# EAGLE design TxPCB_V1-1 (EAGLE 9.6.2)
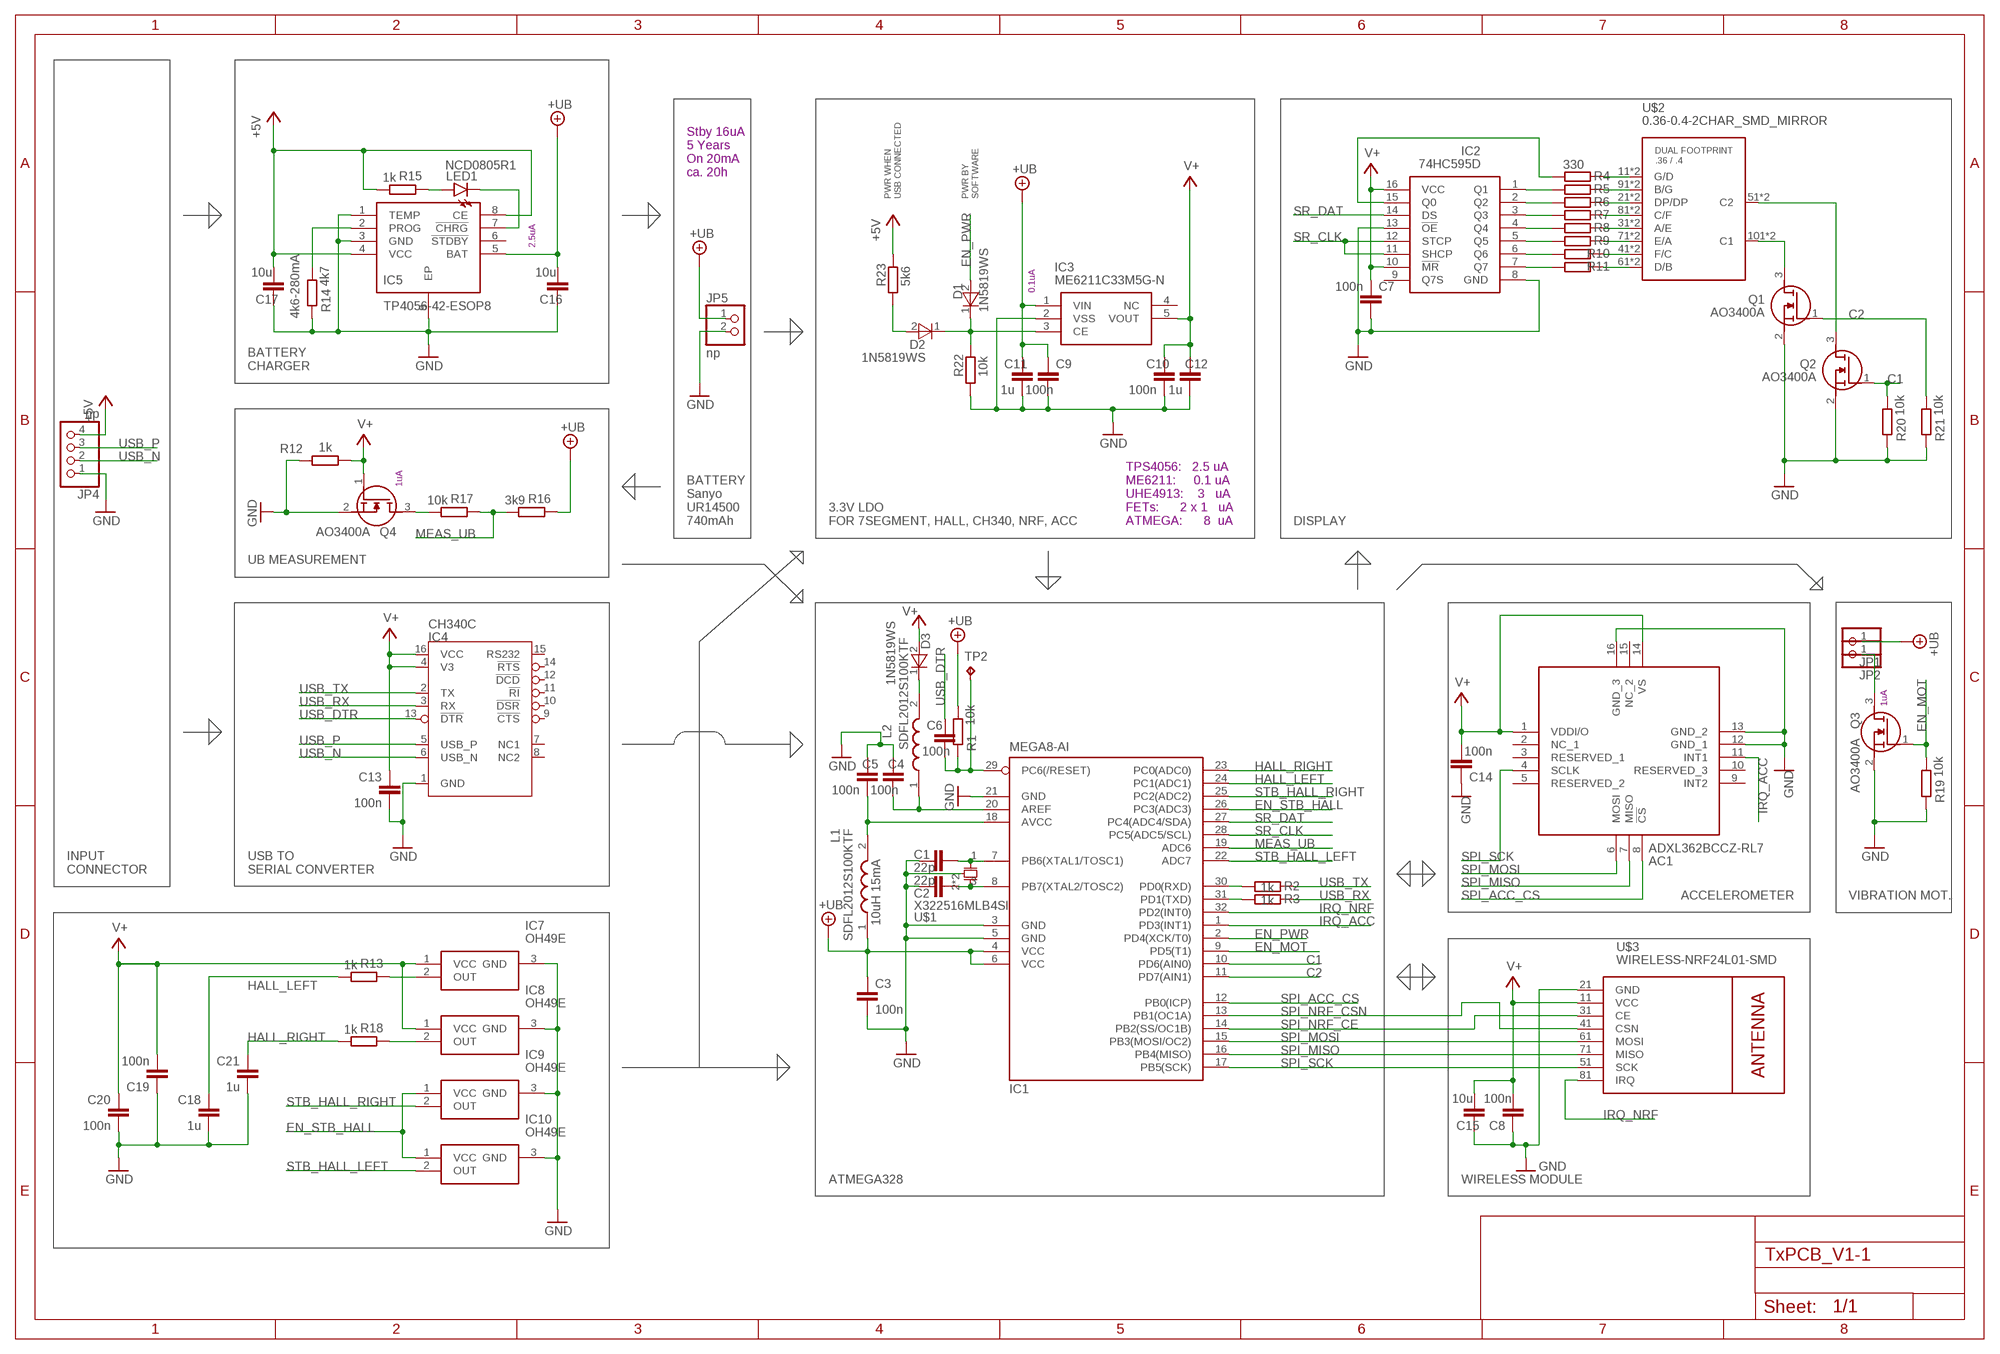
[diagram p0: schematic, sheet 1]

## Parts
AC1  ADXL362BCCZ-RL7  [CC-16-4]
C1  22p  C-EUC0603  [C0603]
C2  22p  C-EUC0603  [C0603]
C3  100n  C-EUC0603  [C0603]
C4  100n  C-EUC0603  [C0603]
C5  100n  C-EUC0603  [C0603]
C6  100n  C-EUC0603  [C0603]
C7  100n  C-EUC0603  [C0603]
C8  100n  C-EUC0603  [C0603]
C9  100n  C-EUC0603  [C0603]
C10  100n  C-EUC0603  [C0603]
C11  1u  C-EUC0603  [C0603]
C12  1u  C-EUC0603  [C0603]
C13  100n  C-EUC0603  [C0603]
C14  100n  C-EUC0603  [C0603]
C15  10u  C-EUC0603  [C0603]
C16  10u  C-EUC0603  [C0603]
C17  10u  C-EUC0603  [C0603]
C18  1u  C-EUC0603  [C0603]
C19  100n  C-EUC0603  [C0603]
C20  100n  C-EUC0603  [C0603]
C21  1u  C-EUC0603  [C0603]
D1  1N5819WS  1N4148WS  [SODFL2512X90N]
D2  1N5819WS  1N4148WS  [SODFL2512X90N]
D3  1N5819WS  1N4148WS  [SODFL2512X90N]
IC1  MEGA8-AI  [TQFP32-08]
IC2  74HC595D  [SOIC127P600X175-16N]
IC3  ME6211C33M5G-N  ME6211C50M5G  [SOT95P282X145-5N]
IC4  CH340C  CH340G  [SOIC16N]
IC5  TP4056-42-ESOP8  [SOIC127P600X175-9N]
IC7  OH49E  DRV5055A3QDBZR  [SOT95P237X112-3N]
IC8  OH49E  DRV5055A3QDBZR  [SOT95P237X112-3N]
IC9  OH49E  DRV5055A3QDBZR  [SOT95P237X112-3N]
IC10  OH49E  DRV5055A3QDBZR  [SOT95P237X112-3N]
JP1  PINHD-1X1  [1X01]
JP2  PINHD-1X1  [1X01]
JP4  np  PINHD-1X4  [1X04]
JP5  np  PINHD-1X2  [1X02]
L1  SDFL2012S100KTF  SDFL2012Q2R7KTF  [INDC2112X105N]
L2  SDFL2012S100KTF  SDFL2012Q2R7KTF  [INDC2112X105N]
LED1  NCD0805R1  LEDCHIP-LED0805  [CHIP-LED0805]
Q1  AO3400A  [SOT95P280X125-3N]
Q2  AO3400A  [SOT95P280X125-3N]
Q3  AO3400A  [SOT95P280X125-3N]
Q4  AO3400A  [SOT95P280X125-3N]
R1  10k  R-EU_R0603  [R0603]
R2  1k  R-EU_R0603  [R0603]
R3  1k  R-EU_R0603  [R0603]
R4  330  R-EU_R0603  [R0603]
R5  330  R-EU_R0603  [R0603]
R6  330  R-EU_R0603  [R0603]
R7  330  R-EU_R0603  [R0603]
R8  330  R-EU_R0603  [R0603]
R9  330  R-EU_R0603  [R0603]
R10  330  R-EU_R0603  [R0603]
R11  330  R-EU_R0603  [R0603]
R12  1k  R-EU_R0603  [R0603]
R13  1k  R-EU_R0603  [R0603]
R14  4k7  R-EU_R0603  [R0603]
R15  1k  R-EU_R0603  [R0603]
R16  3k9  R-EU_R0603  [R0603]
R17  10k  R-EU_R0603  [R0603]
R18  1k  R-EU_R0603  [R0603]
R19  10k  R-EU_R0603  [R0603]
R20  10k  R-EU_R0603  [R0603]
R21  10k  R-EU_R0603  [R0603]
R22  10k  R-EU_R0603  [R0603]
R23  5k6  R-EU_R0603  [R0603]
TP2  TPB1,27  [B1,27]
U$1  X322516MLB4SI  X322516_BETTER  [X322516MLB4SI]
U$2  0.36-0.4-2CHAR_SMD_MIRROR  [COMBO-036-04_SMD]
U$3  WIRELESS-NRF24L01-SMD  [WIRELESS-NRF24L01_SMD]

## Nets
+5V: C17.1 IC5.4(VCC) IC5.8(CE) JP4.4 R15.2 R23.2
+UB: C3.1 C9.1 C11.1 C16.1 IC1.4(VCC) IC1.6(VCC) IC3.1(VIN) IC5.5(BAT) JP1.1 JP5.1 L1.1 R1.2 R16.1
C1: IC1.10(PD6(AIN0)) Q2.1(G) R20.2
C2: IC1.11(PD7(AIN1)) Q1.1(G) R21.2
EN_MOT: IC1.9(PD5(T1)) Q3.1(G) R19.2
EN_PWR: D1.2(A) IC1.2(PD4(XCK/T0))
EN_STB_HALL: IC1.26(PC3(ADC3)) IC9.1(VCC) IC10.1(VCC)
GND: AC1.12(GND_1) AC1.13(GND_2) AC1.16(GND_3) C1.2 C2.2 C3.2 C4.1 C5.1 C7.2 C8.1 C9.2 C10.2 C11.2 C12.2 C13.2 C14.1 C15.2 C16.2 C17.2 C18.2 C19.1 C20.2 C21.2 IC1.3(GND) IC1.5(GND) IC1.21(GND) IC2.8(GND) IC2.13(!OE) IC3.2(VSS) IC4.1(GND) IC5.1(TEMP) IC5.3(GND) IC5.9(EP) IC7.3(GND) IC8.3(GND) IC9.3(GND) IC10.3(GND) JP4.1 JP5.2 Q1.2(S) Q2.2(S) Q3.2(S) Q4.2(S) R12.1 R14.1 R19.1 R20.1 R21.1 R22.1 U$1.2(G) U$1.4(G) U$3.21(GND)
HALL_LEFT: C18.1 IC1.24(PC1(ADC1)) R13.2
HALL_RIGHT: C21.1 IC1.23(PC0(ADC0)) R18.2
IRQ_ACC: AC1.11(INT1) IC1.1(PD3(INT1))
IRQ_NRF: IC1.32(PD2(INT0)) U$3.81(IRQ)
MEAS_UB: IC1.19(ADC6) R16.2 R17.1
N$1: C1.1 IC1.7(PB6(XTAL1/TOSC1)) U$1.1(X1)
N$2: C2.1 IC1.8(PB7(XTAL2/TOSC2)) U$1.3(X2)
N$3: C5.2 IC1.18(AVCC) L1.2
N$4: Q4.3(D) R17.2
N$5: C6.2 IC1.29(PC6(/RESET)) R1.1 TP2.TP
N$6: IC1.30(PD0(RXD)) R2.2
N$7: IC1.31(PD1(TXD)) R3.2
N$8: R4.1 U$2.11(G/D) U$2.12(G/D)
N$9: R5.1 U$2.91(B/G) U$2.92(B/G)
N$10: R6.1 U$2.21(DP/DP) U$2.22(DP/DP)
N$11: R7.1 U$2.81(C/F) U$2.82(C/F)
N$12: R8.1 U$2.31(A/E) U$2.32(A/E)
N$13: R9.1 U$2.71(E/A) U$2.72(E/A)
N$14: R10.1 U$2.41(F/C) U$2.42(F/C)
N$15: R11.1 U$2.61(D/B) U$2.62(D/B)
N$16: Q1.3(D) U$2.101(C1) U$2.102(C1)
N$17: Q2.3(D) U$2.51(C2) U$2.52(C2)
N$18: IC2.1(Q1) R5.2
N$19: IC2.2(Q2) R6.2
N$20: IC2.3(Q3) R7.2
N$21: IC2.4(Q4) R8.2
N$22: IC2.5(Q5) R9.2
N$23: IC2.6(Q6) R10.2
N$24: IC2.7(Q7) R11.2
N$25: IC2.15(Q0) R4.2
N$26: D2.2(A) R23.1
N$27: C4.2 IC1.20(AREF) L2.1
N$28: D3.1(K) L2.2
N$30: IC8.2(OUT) R18.1
N$31: D1.1(K) D2.1(K) IC3.3(CE) R22.2
N$32: LED1.A R15.1
N$33: IC5.7(!CHRG) LED1.C
N$34: JP2.1 Q3.3(D)
N$35: IC5.2(PROG) R14.2
N$36: IC7.2(OUT) R13.1
SPI_ACC_CS: AC1.8(!CS) IC1.12(PB0(ICP))
SPI_MISO: AC1.7(MISO) IC1.16(PB4(MISO)) U$3.71(MISO)
SPI_MOSI: AC1.6(MOSI) IC1.15(PB3(MOSI/OC2)) U$3.61(MOSI)
SPI_NRF_CE: IC1.14(PB2(SS/OC1B)) U$3.31(CE)
SPI_NRF_CSN: IC1.13(PB1(OC1A)) U$3.41(CSN)
SPI_SCK: AC1.4(SCLK) IC1.17(PB5(SCK)) U$3.51(SCK)
SR_CLK: IC1.28(PC5(ADC5/SCL)) IC2.11(SHCP) IC2.12(STCP)
SR_DAT: IC1.27(PC4(ADC4/SDA)) IC2.14(DS)
STB_HALL_LEFT: IC1.22(ADC7) IC10.2(OUT)
STB_HALL_RIGHT: IC1.25(PC2(ADC2)) IC9.2(OUT)
USB_DTR: C6.1 IC4.13(!DTR)
USB_N: IC4.6(USB_N) JP4.2
USB_P: IC4.5(USB_P) JP4.3
USB_RX: IC4.3(RX) R3.1
USB_TX: IC4.2(TX) R2.1
V+: AC1.1(VDDI/O) AC1.14(VS) C7.1 C8.2 C10.1 C12.1 C13.1 C14.2 C15.1 C19.2 C20.1 D3.2(A) IC2.10(!MR) IC2.16(VCC) IC3.5(VOUT) IC4.4(V3) IC4.16(VCC) IC7.1(VCC) IC8.1(VCC) Q4.1(G) R12.2 U$3.11(VCC)
Unconnected: AC1.2(NC_1) AC1.3(RESERVED_1) AC1.5(RESERVED_2) AC1.9(INT2) AC1.10(RESERVED_3) AC1.15(NC_2) IC2.9(Q7S) IC3.4(NC) IC4.7(NC1) IC4.8(NC2) IC4.9(!CTS) IC4.10(!DSR) IC4.11(!RI) IC4.12(!DCD) IC4.14(!RTS) IC4.15(RS232) IC5.6(!STDBY)

## Notes on the sheet
- Stby 16uA
  5 Years
  On 20mA
  ca. 20h
- PWR WHEN
  USB CONNECTED
- PWR BY
  SOFTWARE
- 2.5uA
- 0.1uA
- 4k6-280mA
- BATTERY
  CHARGER
- 1uA
- BATTERY
  Sanyo
  UR14500
  740mAh
- 3.3V LDO
  FOR 7SEGMENT, HALL, CH340, NRF, ACC
- TPS4056:   2.5 uA
  ME6211:     0.1 uA
  UHE4913:    3   uA
  FETs:      2 x 1   uA
  ATMEGA:      8  uA
- DISPLAY
- UB MEASUREMENT
- 1uA
- INPUT
  CONNECTOR
- USB TO
  SERIAL CONVERTER
- ACCELEROMETER | VIBRATION MOT.
- 10uH 15mA
- ATMEGA328 | WIRELESS MODULE

## Library data of the parts
AC1 = ADXL362BCCZ-RL7:ADXL362BCCZ-RL7: Accelerometers Micropower 3-Axis Digital Output MEMS Source: Datasheet <http://www.analog.com/media/en/technical-documentation/data-sheets/ADXL362.pdf>; ARROW_PART_NUMBER: ADXL362BCCZ-RL7; ARROW_PRICE-STOCK: https://www.arrow.com/en/products/adxl362bccz-rl7/analog-devices?region=nac; DESCRIPTION: Accelerometers Micropower 3-Axis Digital Output MEMS; HEIGHT: mm; MANUFACTURER_NAME: Analog Devices; MANUFACTURER_PART_NUMBER: ADXL362BCCZ-RL7; MOUSER_PART_NUMBER: 584-ADXL362BCCZ-R7; MOUSER_PRICE-STOCK: https://www.mouser.co.uk/ProductDetail/Analog-Devices/ADXL362BCCZ-RL7?qs=WIvQP4zGanhCOhEEyirq5Q%3D%3D
C1-C21 = rcl:C-EU: CAPACITOR, European symbol; SPICEPREFIX: C
D1-D3 = 1N4148WS:1N4148WS: ON Semiconductor Switching Diode, 300mA 75V, 2-Pin SOD-323 1N4148WS Source: Datasheet; ARROW_PART_NUMBER: 1N4148WS; ARROW_PRICE-STOCK: https://www.arrow.com/en/products/1n4148ws/on-semiconductor?region=nac; DESCRIPTION: ON Semiconductor Switching Diode, 300mA 75V, 2-Pin SOD-323 1N4148WS; HEIGHT: 0.9mm; MANUFACTURER_NAME: onsemi; MANUFACTURER_PART_NUMBER: 1N4148WS; MOUSER_PART_NUMBER: 512-1N4148WS; MOUSER_PRICE-STOCK: https://www.mouser.co.uk/ProductDetail/ON-Semiconductor-Fairchild/1N4148WS?qs=2%2FYqgE%252BHg%252BKBrKZlAsMLhw%3D%3D
IC1 = atmel:MEGA8: MICROCONTROLLER 8 Kbytes FLASH, 1 kbytes SRAM, 512 bytes EEPROM, USART, 6-channel 10 bit ADC, 2-channel 8 bit ADC Pin compatible with Atmega48, ATMega88, ATMega168 Source: avr.lbr; MPN: ATMEGA8-16AU; OC_FARNELL: 9171371; OC_NEWARK: 73M8863
IC2 = 74HC595D:74HC595D: Shift Register, 16 Pin, Plastic, SOP Source: Datasheet <https://assets.nexperia.com/documents/data-sheet/74HC_HCT595.pdf>; DESCRIPTION: Shift Register, 16 Pin, Plastic, SOP; HEIGHT: 1.75mm; MANUFACTURER_NAME: NXP; MANUFACTURER_PART_NUMBER: 74HC595D; MOUSER_PART_NUMBER: N/A; MOUSER_PRICE-STOCK: https://www.mouser.co.uk/ProductDetail/NXP-Semiconductors/74HC595D?qs=KBAwV6Cvgt0f%252BALigJeNTw%3D%3D
IC3 = ME6211C50M5G:ME6211C50M5G: ME6211C50M5G Source: Datasheet <https://atta.szlcsc.com/upload/public/pdf/source/20180709/C236670_CE73D272779D26EBD8CFC2246415DB9C.pdf>; DESCRIPTION: ME6211C50M5G; HEIGHT: 1.45mm; MANUFACTURER_NAME: Microne; MANUFACTURER_PART_NUMBER: ME6211C50M5G
IC4 = CH340:CH340G
IC5 = TP4056-42-ESOP8:TP4056-42-ESOP8: PMIC - Battery Management ESOP-8 RoHS Source: Datasheet <https://datasheet.lcsc.com/szlcsc/1906261508_Nanjing-Extension-Microelectronics-TP4056-42-ESOP8_C16581.pdf>; DESCRIPTION: PMIC - Battery Management ESOP-8 RoHS; HEIGHT: 1.75mm; MANUFACTURER_NAME: Nanjing Extension Microelectronics; MANUFACTURER_PART_NUMBER: TP4056-42-ESOP8
IC7-IC10 = DRV5055A3QDBZR:DRV5055A3QDBZR: Hall Effect Sensor 1mA Ratiometric 3.3V/5V 3-Pin SOT-23 T/R Source: Datasheet <http://www.ti.com/general/docs/suppproductinfo.tsp?distId=10&gotoUrl=http://www.ti.com/lit/gpn/drv5055>; ARROW_PART_NUMBER: DRV5055A3QDBZR; ARROW_PRICE-STOCK: https://www.arrow.com/en/products/drv5055a3qdbzr/texas-instruments; DESCRIPTION: Hall Effect Sensor 1mA Ratiometric 3.3V/5V 3-Pin SOT-23 T/R; HEIGHT: 1.12mm; MANUFACTURER_NAME: Texas Instruments; MANUFACTURER_PART_NUMBER: DRV5055A3QDBZR; MOUSER_PART_NUMBER: 595-DRV5055A3QDBZR; MOUSER_PRICE-STOCK: https://www.mouser.co.uk/ProductDetail/Texas-Instruments/DRV5055A3QDBZR?qs=rrS6PyfT74dO6qwrOH6T8w%3D%3D
JP1 JP2 = pinhead:PINHD-1X1: PIN HEADER
JP4 = pinhead:PINHD-1X4: PIN HEADER
JP5 = pinhead:PINHD-1X2: PIN HEADER
L1 L2 = SDFL2012Q2R7KTF:SDFL2012Q2R7KTF: Multi-layer Chip Ferrite Inductor Source: Datasheet <https://datasheet.lcsc.com/szlcsc/Sunlord-SDFL2012Q2R7KTF_C74318.pdf>; DESCRIPTION: Multi-layer Chip Ferrite Inductor; HEIGHT: 1.05mm; MANUFACTURER_NAME: SUNLORD; MANUFACTURER_PART_NUMBER: SDFL2012Q2R7KTF
LED1 = led:LED: LED OSRAM: - CHIPLED LG R971, LG N971, LY N971, LG Q971, LY Q971, LO R971, LY R971 LH N974, LH R974 LS Q976, LO Q976, LY Q976 LO Q996 - Hyper CHIPLED LW Q18S LB Q993, LB Q99A, LB R99A - SideLED LS A670, LO A670, LY A670, LG A670, LP A670 LB A673, LV A673, LT A673, LW A673 LH A674 LY A675 LS A676, LA A676, LO A676, LY A676, LW A676 LS A679, LY A679, LG A679 - Hyper Micro SIDELED® LS Y876, LA Y876, LO Y876, LY Y876 LT Y87S - SmartLED LW L88C, LW L88S LB L89C, LB L89S, LG L890 LS L89K, LO L89K, LY L89K LS L896, LA L896, LO L896, LY L896 - TOPLED LS T670, LO T670, LY T670, LG T670, LP T670 LSG T670, LSP T670, LSY T670, LOP T670, LYG T670 LG T671, LOG T671, LSG T671 LB T673, LV T673, LT T673, LW T673 LH T674 LS T676, LA T676, LO T676, LY T676, LB T676, LH T676, LSB T676, LW T676 LB T67C, LV T67C, LT T67C, LS T67K, LO T67K, LY T67K, LW E67C LS E67B, LA E67B, LO E67B, LY E67B, LB E67C, LV E67C, LT E67C LW T67C LS T679, LY T679, LG T679 LS T770, LO T770, LY T770, LG T770, LP T770 LB T773, LV T773, LT T773, LW T773 LH T774 LS E675, LA E675, LY E675, LS T675 LS T776, LA T776, LO T776, LY T776, LB T776 LHGB T686 LT T68C, LB T68C - Hyper Mini TOPLED® LB M676 - Mini TOPLED Santana® LG M470 LS M47K, LO M47K, LY M47K Source: http://www.osram.convergy.de LUXEON: - LUMILED® LXK2-PW12-R00, LXK2-PW12-S00, LXK2-PW14-U00, LXK2-PW14-V00 LXK2-PM12-R00, LXK2-PM12-S00, LXK2-PM14-U00 LXK2-PE12-Q00, LXK2-PE12-R00, LXK2-PE12-S00, LXK2-PE14-T00, LXK2-PE14-U00 LXK2-PB12-K00, LXK2-PB12-L00, LXK2-PB12-M00, LXK2-PB14-N00, LXK2-PB14-P00, LXK2-PB14-Q00 LXK2-PR12-L00, LXK2-PR12-M00, LXK2-PR14-Q00, LXK2-PR14-R00 LXK2-PD12-Q00, LXK2-PD12-R00, LXK2-PD12-S00 LXK2-PH12-R00, LXK2-PH12-S00 LXK2-PL12-P00, LXK2-PL12-Q00, LXK2-PL12-R00 Source: www.luxeon.com KINGBRIGHT: KA-3528ASYC Source: www.kingbright.com
Q1-Q4 = AO3400A:AO3400A: 30V N-Channel MOSFET Source: Datasheet <http://aosmd.com/res/data_sheets/AO3400A.pdf>; ARROW_PART_NUMBER: AO3400A; ARROW_PRICE-STOCK: https://www.arrow.com/en/products/ao3400a/alpha-and-omega-semiconductor?region=nac; DESCRIPTION: 30V N-Channel MOSFET; HEIGHT: 1.25mm; MANUFACTURER_NAME: Alpha & Omega Semiconductors; MANUFACTURER_PART_NUMBER: AO3400A
R1-R23 = rcl:R-EU_: RESISTOR, European symbol; SPICEPREFIX: R
TP2 = testpad:TP: Test pad
U$1 = X322516MLB4SI:X322516_BETTER
U$2 = 7SEG_36_40_COMBO:0.36-0.4-2CHAR_SMD_MIRROR
U$3 = diy-modules:WIRELESS-NRF24L01-SMD

## Board
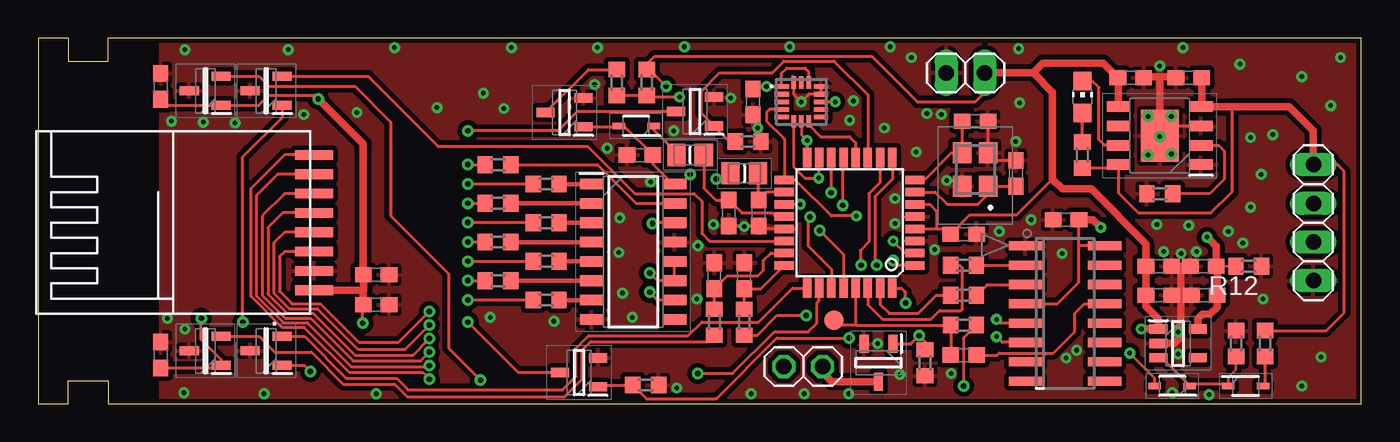
[diagram p1: board, top side]
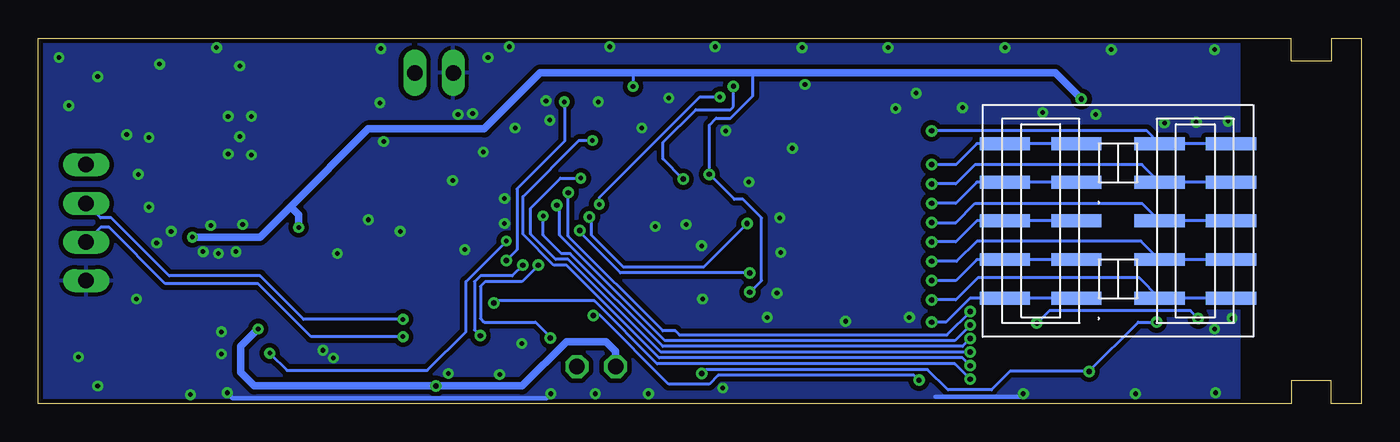
[diagram p2: board, bottom side, seen from below]

Size 86.98 x 24 mm. Coordinates in mm from the lower left corner, seen from the top.
Outline: 0,0 2,0 2,1.5 4.6,1.5 4.6,0 86.98,0 86.98,24 4.6,24 4.6,22.5 2,22.5 2,24 0,24 0,0
Copper layers (1*16): Top 0.035mm / dielectric 1.5mm / Bottom 0.035mm
Design rules "jlcpcb *": minimum track width 3.5mil, minimum drill 0.2mm, track to track 3.5mil, track to pad 5mil, pad to pad 5mil, via to via 5mil, smd to smd 0mil, copper to edge 0.2mm, drill to drill 8mil, minimum pad ring 10mil, minimum via ring 8mil, stop-mask expansion 4mil, vias tented up to drill 0mil, thermal gap 10mil
tRestrict: area -0.6,-1.1 to 7.6,25.5
bRestrict: area -0.6,-1.1 to 7.6,25.5

### Footprints (pad centres in the part's own frame; a part is rotated, then mirrored left to right if it is on the bottom)
CC-16-4 = smd 0.925 x 0.3: 1 -1.288,1; 2 -1.288,0.5; 3 -1.288,0; 4 -1.288,-0.5; 5 -1.288,-1; 9 1.288,-1; 10 1.288,-0.5; 11 1.288,0; 12 1.288,0.5; 13 1.288,1 | smd 0.3 x 0.8: 6 -0.5,-1.275; 7 0,-1.275; 8 0.5,-1.275; 14 0.5,1.275; 15 0,1.275; 16 -0.5,1.275
C0603 = smd 1.1 x 1: 1 -0.85,0; 2 0.85,0
SODFL2512X90N = smd 0.82 x 0.42: 1 -1.15,0; 2 1.15,0
TQFP32-08 = smd 1.27 x 0.559: 1 -4.293,2.8; 2 -4.293,2; 3 -4.293,1.2; 4 -4.293,0.4; 5 -4.293,-0.4; 6 -4.293,-1.2; 7 -4.293,-2; 8 -4.293,-2.8; 17 4.293,-2.8; 18 4.293,-2; 19 4.293,-1.2; 20 4.293,-0.4; 21 4.293,0.4; 22 4.293,1.2; 23 4.293,2; 24 4.293,2.8 | smd 0.559 x 1.27: 9 -2.8,-4.293; 10 -2,-4.293; 11 -1.2,-4.293; 12 -0.4,-4.293; 13 0.4,-4.293; 14 1.2,-4.293; 15 2,-4.293; 16 2.8,-4.293; 25 2.8,4.293; 26 2,4.293; 27 1.2,4.293; 28 0.4,4.293; 29 -0.4,4.293; 30 -1.2,4.293; 31 -2,4.293; 32 -2.8,4.293
SOIC127P600X175-16N = smd 1.55 x 0.7: 1 -2.725,4.445; 2 -2.725,3.175; 3 -2.725,1.905; 4 -2.725,0.635; 5 -2.725,-0.635; 6 -2.725,-1.905; 7 -2.725,-3.175; 8 -2.725,-4.445; 9 2.725,-4.445; 10 2.725,-3.175; 11 2.725,-1.905; 12 2.725,-0.635; 13 2.725,0.635; 14 2.725,1.905; 15 2.725,3.175; 16 2.725,4.445
SOT95P282X145-5N = smd 1.2 x 0.6: 1 -1.3,0.95; 2 -1.3,0; 3 -1.3,-0.95; 4 1.3,-0.95; 5 1.3,0.95
SOIC16N = smd 2.2 x 0.6: 1 -2.6,4.445; 2 -2.6,3.175; 3 -2.6,1.905; 4 -2.6,0.635; 5 -2.6,-0.635; 6 -2.6,-1.905; 7 -2.6,-3.175; 8 -2.6,-4.445; 9 2.6,-4.445; 10 2.6,-3.175; 11 2.6,-1.905; 12 2.6,-0.635; 13 2.6,0.635; 14 2.6,1.905; 15 2.6,3.175; 16 2.6,4.445
SOIC127P600X175-9N = smd 1.525 x 0.7: 1 -2.712,1.905; 2 -2.712,0.635; 3 -2.712,-0.635; 4 -2.712,-1.905; 5 2.712,-1.905; 6 2.712,-0.635; 7 2.712,0.635; 8 2.712,1.905 | smd 2.513 x 3.402: 9 0,0
SOT95P237X112-3N = smd 1.25 x 0.6: 1 -1.05,0.95; 2 -1.05,-0.95; 3 1.05,0
1X01 = drill 1.016 octagon: 1 0,0
1X04 = drill 1.016 long: 1 -3.81,0; 2 -1.27,0; 3 1.27,0; 4 3.81,0
1X02 = drill 1.016 long: 1 -1.27,0; 2 1.27,0
INDC2112X105N = smd 1.2 x 1.45: 1 -0.9,0; 2 0.9,0
CHIP-LED0805 = smd 1.2 x 1.2: A 0,-1.05; C 0,1.05
SOT95P280X125-3N = smd 1.2 x 0.6: 1 -1.25,0.95; 2 -1.25,-0.95; 3 1.25,0
R0603 = smd 1 x 1.1: 1 -0.85,0; 2 0.85,0
B1,27 = smd 1.27 x 1.27: TP 0,0
X322516MLB4SI = smd 1.4 x 1.2: 1 -1.1,-0.85; 2 1.1,-0.85; 3 1.1,0.85; 4 -1.1,0.85
COMBO-036-04_SMD = smd 0.85 x 3.3: 11 -5.08,-7.43; 12 -5.08,-2.73; 21 -2.54,-7.43; 22 -2.54,-2.73; 31 0,-7.43; 32 0,-2.73; 41 2.54,-7.43; 42 2.54,-2.73; 51 5.08,-7.43; 52 5.08,-2.73; 61 5.08,2.73; 62 5.08,7.43; 71 2.54,2.73; 72 2.54,7.43; 81 0,2.73; 82 0,7.43; 91 -2.54,2.73; 92 -2.54,7.43; 101 -5.08,2.73; 102 -5.08,7.43
WIRELESS-NRF24L01_SMD = smd 2.5 x 0.635: 11 -9.153,4.445; 21 -9.153,3.175; 31 -9.153,1.905; 41 -9.153,0.635; 51 -9.153,-0.635; 61 -9.153,-1.905; 71 -9.153,-3.175; 81 -9.153,-4.445

### Placement (x,y rotation side)
AC1  50.16,19.82 0 top
C1  64.26,15.12 90 top
C2  61.59,18.55 0 top
C3  60.83,11.12 0 top
C4  45.4,12.52 90 top
C5  47.37,12.52 90 top
C6  60.83,3.18 180 top
C7  39.56,16.33 180 top
C8  22.23,8.45 180 top
C9  73.66,7.12 0 top
C10  76.64,7.12 180 top
C11  73.66,9.03 0 top
C12  76.58,9.03 180 top
C13  67.56,12.07 180 top
C14  46.99,19.82 90 top
C15  22.23,6.49 0 top
C16  71.82,21.41 0 top
C17  75.63,21.41 180 top
C18  46.42,8.39 90 top
C19  8.06,3.18 270 top
C20  8.06,20.84 90 top
C21  44.45,8.39 90 top
D1  74.55,1.15 180 top
D2  79.38,1.15 0 top
D3  39.31,18.23 180 top
IC1  53.34,11.88 180 top
IC2  39.12,9.97 0 top
IC3  74.93,3.95 0 top
IC4  67.5,5.91 0 top
IC5  73.72,17.6 180 top
IC7  11,20.54 180 top
IC8  11,3.46 180 top
IC9  15,3.46 180 top
IC10  15,20.54 180 top
JP1  49.02,2.42 0 top
JP2  51.56,2.42 0 top
JP4  83.82,11.88 90 top
JP5  60.96,21.73 180 top
L1  46.42,15.12 0 top
L2  42.86,16.33 180 top
LED1  68.64,20.14 0 top
Q1  43.18,19.18 180 top
Q2  35.56,2.04 180 top
Q3  55.24,2.67 270 top
Q4  34.61,19.12 180 top
R1  60.83,5.15 0 top
R2  60.83,9.09 180 top
R3  60.83,7.12 180 top
R4  30.23,15.69 0 top
R5  33.4,14.42 0 top
R6  30.23,13.15 0 top
R7  33.4,11.88 0 top
R8  30.23,10.61 0 top
R9  33.4,9.34 0 top
R10  30.23,8.07 0 top
R11  33.4,6.8 0 top
R12  79.57,9.03 180 top
R13  46.42,5.34 90 top
R14  73.72,13.79 0 top
R15  68.64,16.33 270 top
R16  40.01,21.09 270 top
R17  38.04,21.09 90 top
R18  44.45,5.34 90 top
R19  58.29,2.67 90 top
R20  39.94,1.21 180 top
R21  46.67,17.22 180 top
R22  78.74,3.95 270 top
R23  80.64,3.95 90 top
TP2  52.32,5.47 0 top
U$1  61.59,15.38 90 top
U$2  16,12 270 bottom
U$3  9,11.88 180 top

### Tracks (layer width: path | path; a pad name or v marks a point on that pad's centre or on a via)
+5V
  Top 0.2: R15.2 70.8,15.48 IC5.8 71.01,13.83 72.33,12.52 77.09,12.52 78.49,13.91 78.49,19.5 | R23.2 84.67,4.79 85.85,5.98 85.85,15.25 85.41,15.69 JP4.4
  Top 0.508: C17.1 76.48,19.55 IC5.4 78.49,19.5 82.23,19.5 83.82,17.91 JP4.4
+UB  (via drill 0.3 pad 0.4, 0.35)
  Top 0.2: JP5.1 62.23,20.45 61.59,19.82 57.78,19.82 54.8,22.8 40.52,22.8 40.01,22.29 R16.1 40.17,21.94 v41.27,20.84 | IC1.4 59.05,11.48 | 59.05,11.48 59.05,12.64 58.62,13.08 IC1.6 | 59.05,11.48 59.62,11.48 C3.1 61.25,12.39 64.33,12.39 66.67,14.74 | R1.2 60.83,4.3 v60.83,1.15 | L1.1 45.14,14.74 v44.58,14.74
  Top 0.508: IC5.5 71.01,21.36 C16.1 70.02,22.36 66.04,22.36 65.41,21.73 | 65.41,21.73 JP5.1 | 65.41,21.73 66.67,20.45 66.67,14.74 67.31,14.11 69.22,14.11 72.81,10.51 C11.1 C9.1 72.81,6.38 73.63,5.56 IC3.1 v72.52,4.9
  Bottom 0.2: v44.58,14.74 45.91,16.07 45.91,17.15 43.75,19.31 41.47,19.31 41.27,19.5 v41.27,20.84
  Bottom 0.508: v72.52,4.9 73.66,3.75 73.66,2.04 72.77,1.15 v60.83,1.15 55.18,1.15 52.26,4.07 49.66,4.07 49.02,3.44 JP1.1
C1  (via drill 0.35)
  Top 0.2: Q2.1 36.93,1.21 R20.2 39.98,0.33 44.58,0.33 48.55,4.29 v53.31,4.29 | IC1.10 55.34,14.52 54.61,13.79 54.61,10.61 54.04,10.04 54.04,9.15 v54.1,9.09
  Bottom 0.2: v54.1,9.09 55.18,8.01 57.59,8.01 57.91,7.69 57.91,5.6 57.66,5.34 54.29,5.34 53.28,4.33 v53.31,4.29
C2
  Top 0.2: IC1.11 54.54,20.27 52.32,22.49 49.02,22.49 48.26,21.73 44.8,21.73 43.6,20.53 43.6,19.06 Q1.1 44.43,18.19 45.4,17.22 R21.2
EN_MOT  (via drill 0.35)
  Top 0.2: IC1.9 56.14,14.75 54.99,13.6 54.99,9.22 v55.12,9.09 | R19.2 58.29,4.07 v57.91,4.45 57.38,3.92 Q3.1
  Bottom 0.2: v55.12,9.09 55.82,8.39 57.91,8.39 58.29,8.01 58.29,4.83 v57.91,4.45
EN_PWR  (via drill 0.3 pad 0.4)
  Top 0.2: D1.2 73.4,1.67 v71.75,3.31 | v56.2,10.68 56.99,9.88 IC1.2
  Bottom 0.2: v56.2,10.68 58.86,8.01 58.86,4.71 61.4,2.18 70.62,2.18 v71.75,3.31
EN_STB_HALL  (via drill 0.35)
  Top 0.2: IC9.1 17.5,2.51 v17.91,2.1 | v13.46,5.34 13.46,16.2 16.07,18.8 16.07,19.58 IC10.1 | IC1.26 51.34,6.77 51.18,6.61 51.18,5.28 50.61,4.71 48.39,4.71 45.66,1.98 v43.37,1.98
  Bottom 0.2: v13.46,5.34 14.67,5.34 v17.91,2.1 23.11,2.1 24.32,0.9 27.18,0.9 28.51,2.23 43.05,2.23 43.31,1.98 v43.37,1.98
GND  (via drill 0.3 pad 0.4)
  Top 0.2: C2.2 U$1.2 62.95,15.97 C1.2 | C4.1 C5.1 47.56,11.48 IC1.21 | AC1.16 49.66,20.32 v50.16,19.82 50.66,20.32 AC1.12 AC1.13 | 73.72,16.64 IC5.9 73.72,17.98 73.98,18.23 IC5.3 | C14.1 47.31,18.65 v47.31,18.11 47.31,17.43 R21.1
  Top 0.508: IC3.2 74.68,3.95 75.12,4.39 75.12,7.12 | C11.2 75.12,9.03 | 75.12,9.03 C12.2 | C9.2 75.12,7.12 | C10.2 75.12,7.12 | 75.12,7.12 75.12,9.03 | C16.2 72.73,21.47 73.72,21.47 | 73.72,21.47 74.72,21.47 C17.2 | IC5.9 73.72,21.47
  Bottom 0.305: v22.23,0.64 22.42,0.45 28,0.45 | v53.28,0.64 53.57,0.35 74.19,0.35 v74.55,0.71
  other vias: 59.73,14.66 39.05,5.66 38.23,12.2 64.26,17.22 29.27,20.39 26.23,19.44 30.61,19.38 72.96,18.87 74.49,18.87 74.49,16.39 72.96,16.33 73.72,17.53 75.12,9.85 74.93,3.25 67.31,9.85 65.28,12.07 46.42,11.63 63.18,11.31 73.72,22.17 45.53,20.07 46.86,0.64 60.01,1.98 56.64,1.91 67.56,2.99 55.18,3.95 41.78,17.91 40.26,14.55 56.32,11.82 55.63,18.11 57.72,16.52 53.34,18.61 53.59,19.88 59.37,18.99 58.42,19.06 56.32,13.47 78.23,11.31 79.69,12.9 79.69,17.47 79.18,10.55 73.53,11.76 75.63,11.69 73.98,9.98 76.14,9.98 74.93,4.71 80.39,15.06 78.99,22.3 57.4,22.74 64.52,19.76 80.52,6.87 81.15,17.66 83.06,21.47 84.96,19.57 85.6,22.74 83.06,1.15 84.33,3.06 36.58,20.96 37.4,16.77 41.97,1.02 29.72,5.66 33.91,5.41 38.42,7.25 38.16,9.91 9.65,23.25 16.45,23.25 23.43,23.38 31.11,23.38 36.77,23.38 42.48,23.44 49.4,23.44 56.01,23.44 68.26,3.5 17.46,18.99 20.95,19.12 12.95,18.42 8.76,18.55 10.86,18.49 9.59,0.71 14.86,0.64 9.65,4.9 8.51,5.6 43.31,6.87 43.37,10.36 44.39,11.76 75.25,23.38 64.45,23.31 76.96,0.58 58.93,10.1 50.36,0.64
  pour Top (isolate 0.305): 0,24.9 87,24.9 87,-0.5 0,-0.5
  pour Bottom (isolate 0.305): 0,24.9 0,-0.5 87,-0.5 87,24.9
HALL_LEFT
  Top 0.2: IC1.24 47.51,7.54 C18.1 R13.2
HALL_RIGHT
  Top 0.2: IC1.23 48.16,9.88 47.69,9.41 47.69,8.77 47.31,8.39 45.3,8.39 C21.1 R18.2
IRQ_ACC  (via drill 0.3 pad 0.4, 0.35)
  Top 0.2: AC1.11 v52.39,19.82 | IC1.1 56.52,9.08 v56.2,9.41
  Bottom 0.2: v52.39,19.82 52.39,17.22 55.5,14.11 55.5,10.1 v56.2,9.41
IRQ_NRF  (via drill 0.35)
  Top 0.2: U$3.81 16.2,16.33 13.97,14.11 13.97,7.07 16.02,5.02 17.47,5.02 20.45,2.04 25.27,2.04 v25.72,1.6 | v57.02,6.61 57.02,7.31 56.75,7.59 IC1.32
  Bottom 0.2: v25.72,1.6 26.73,2.61 46.29,2.61 50.42,6.74 56.9,6.74 v57.02,6.61
MEAS_UB  (via drill 0.3 pad 0.4)
  Top 0.2: v50.1,13.09 v50.09,13.08 IC1.19 | R17.1 R16.2 40.11,20.14 v42.16,20.14
  Bottom 0.2: v42.16,20.14 43.5,20.14 50.1,13.53 v50.1,13.09
N$1
  Top 0.2: C1.1 U$1.1 62.45,13.75 61.78,13.09 59.75,13.09 58.96,13.88 IC1.7
N$2
  Top 0.2: C2.1 U$1.3 60.05,16.48 58.25,14.68 IC1.8
N$3
  Top 0.2: IC1.18 47.88,13.88 C5.2 47.32,13.42 L1.2
N$4
  Top 0.2: Q4.3 36.18,21.94 R17.2
N$5
  Top 0.2: C6.2 R1.1 53.78,5.15 53.74,5.2 | IC1.29 53.74,5.21 53.74,5.2 | 53.74,5.2 53.74,5.15 52.32,5.15 TP2.TP
N$6
  Top 0.2: IC1.30 54.54,6.49 55.5,5.53 58.67,5.53 59.24,6.1 60.64,6.1 60.77,6.23 60.77,8.9 60.6,9.06 59.98,9.06 R2.2
N$7
  Top 0.2: IC1.31 55.34,6.52 55.94,5.91 57.85,5.91 59.05,7.12 R3.2
N$8  (via drill 0.35)
  Top 0.2: v28.26,15.69 R4.1
  Bottom 0.2: U$2.12 U$2.11 25.28,17.08 26.67,15.69 v28.26,15.69
N$9  (via drill 0.35)
  Top 0.2: v28.26,14.42 R5.1
  Bottom 0.2: U$2.92 U$2.91 14.42,15.69 25.4,15.69 26.67,14.42 v28.26,14.42
N$10  (via drill 0.35)
  Top 0.2: v28.26,13.15 R6.1
  Bottom 0.2: U$2.22 U$2.21 25.28,14.54 26.67,13.15 v28.26,13.15
N$11  (via drill 0.35)
  Top 0.2: R7.1 v28.26,11.88
  Bottom 0.2: v28.26,11.88 26.67,11.88 25.4,13.15 14.42,13.15 U$2.81 U$2.82
N$12  (via drill 0.35)
  Top 0.2: v28.26,10.61 R8.1
  Bottom 0.2: U$2.32 U$2.31 25.28,12 26.67,10.61 v28.26,10.61
N$13  (via drill 0.35)
  Top 0.2: v28.26,9.34 R9.1
  Bottom 0.2: U$2.72 U$2.71 14.49,10.68 25.27,10.68 26.61,9.34 v28.26,9.34
N$14  (via drill 0.35)
  Top 0.2: v28.26,8.07 R10.1
  Bottom 0.2: U$2.42 U$2.41 25.28,9.46 26.67,8.07 v28.26,8.07
N$15  (via drill 0.35)
  Top 0.2: v28.26,6.8 R11.1
  Bottom 0.2: U$2.62 U$2.61 14.61,8.26 25.21,8.26 26.67,6.8 v28.26,6.8
N$16  (via drill 0.35)
  Top 0.2: Q1.3 35.43,19.18 34.16,17.91 v28.26,17.91
  Bottom 0.2: U$2.102 U$2.101 14.11,17.91 v28.26,17.91
N$17  (via drill 0.35)
  Top 0.2: v28.26,5.34 31.56,2.04 Q2.3
  Bottom 0.2: U$2.52 U$2.51 25.73,6.92 27.3,5.34 v28.26,5.34
N$18
  Top 0.305: R5.2 IC2.1
N$19
  Top 0.305: R6.2 IC2.2
N$20
  Top 0.305: R7.2 IC2.3
N$21
  Top 0.305: R8.2 IC2.4
N$22
  Top 0.305: R9.2 IC2.5
N$23
  Top 0.305: R10.2 IC2.6
N$24
  Top 0.305: R11.2 IC2.7
N$25
  Top 0.2: R4.2 36.77,15.69 39.31,13.15 IC2.15
N$26
  Top 0.2: R23.1 80.64,1.27 D2.2
N$27
  Top 0.2: IC1.20 48.5,12.28 48.26,12.52 46.25,12.52 C4.2 44.55,13.37 43.76,14.16 L2.1
N$28
  Top 0.2: D3.1 40.46,17.97 41.96,16.46 L2.2
N$30
  Top 0.2: IC8.2 14.52,4.41 15.56,3.37 17.97,3.37 20.07,1.28 23.43,1.28 24.26,0.45 34.61,0.45 35.75,1.6 35.75,3.5 36.32,4.07 44.03,4.07 R18.1
N$31
  Top 0.152: R22.2 78.74,2.23 78.22,1.72 D2.1
  Top 0.2: IC3.3 73.86,3 D1.1 75.83,1.28 78.1,1.28 D2.1
N$32
  Top 0.2: R15.1 LED1.A
N$33
  Top 0.2: IC5.7 70.1,16.96 69.72,17.34 69.72,20.77 69.31,21.19 LED1.C
N$34
  Top 0.508: Q3.3 52.18,1.43 51.56,2.04 JP2.1
N$35
  Top 0.2: IC5.2 77.6,16.96 77.98,16.58 77.98,14.74 77.03,13.79 R14.2
N$36  (via drill 0.35)
  Top 0.2: IC7.2 14.52,21.49 15.18,20.84 20.83,20.84 23.18,18.49 23.18,12.33 26.99,8.52 26.99,3.63 v29.08,1.53 | R13.1 47.28,4.49 48.58,5.79 v50.48,5.79
  Bottom 0.2: v29.08,1.53 29.4,1.85 42.29,1.85 42.86,1.28 45.53,1.28 50.04,5.79 v50.48,5.79
SPI_ACC_CS
  Top 0.2: AC1.8 50.66,18.3 51.44,17.53 53.34,17.53 53.74,17.13 IC1.12
SPI_MISO  (via drill 0.3 pad 0.4, 0.35)
  Top 0.2: AC1.7 50.16,17.66 v50.54,17.29 IC1.16 | U$3.71 15.75,15.06 14.35,13.66 14.35,7.09 16.14,5.31 17.69,5.31 20.57,2.42 25.65,2.42 v25.72,2.48
  Bottom 0.2: v50.54,17.29 v50.55,17.28 51.44,17.28 55.12,13.6 55.12,11.12 53.09,9.09 52.26,9.09 46.16,2.99 26.23,2.99 v25.72,2.48
SPI_MOSI  (via drill 0.3 pad 0.4, 0.35)
  Top 0.2: AC1.6 49.66,15.56 50.42,14.8 v51.31,14.8 51.34,14.84 IC1.15 | U$3.61 16.2,13.79 14.73,12.33 14.73,7.12 16.26,5.6 17.91,5.6 20.7,2.8 25.15,2.8 v25.72,3.37
  Bottom 0.2: v51.31,14.8 52.64,14.8 54.61,12.84 54.61,11.12 52.96,9.47 52.13,9.47 46.04,3.37 v25.72,3.37
SPI_NRF_CE  (via drill 0.35)
  Top 0.2: U$3.31 16.2,9.98 15.88,9.66 15.88,7.37 16.7,6.55 18.54,6.55 21.08,4.01 23.69,4.01 v25.72,6.04 | v52.13,13.85 IC1.14
  Bottom 0.2: v25.72,6.04 27.24,4.52 44.83,4.52 45.09,4.77 45.91,4.77 52.13,10.99 v52.13,13.85
SPI_NRF_CSN  (via drill 0.35)
  Top 0.2: U$3.41 16.2,11.25 15.49,10.55 15.49,7.25 16.51,6.23 18.35,6.23 21.02,3.56 24.13,3.56 v25.72,5.15 | v52.9,13.03 52.9,16.13 IC1.13
  Bottom 0.2: v25.72,5.15 26.73,4.14 45.78,4.14 52.7,11.06 52.7,12.84 v52.9,13.03
SPI_SCK  (via drill 0.3 pad 0.4, 0.35)
  Top 0.2: AC1.4 48.08,19.32 47.88,19.12 47.88,18.55 49.05,17.38 IC1.17 49.78,14.68 52.14,12.33 v53.78,12.33 | U$3.51 16.07,12.52 15.11,11.56 15.11,7.18 16.38,5.91 18.1,5.91 20.83,3.18 24.64,3.18 v25.72,4.26
  Bottom 0.2: v53.78,12.33 53.78,11.06 52.58,9.85 52.01,9.85 45.91,3.75 26.23,3.75 v25.72,4.26
SR_CLK  (via drill 0.35)
  Top 0.2: IC2.12 IC2.11 40.71,8.07 v40.2,8.58 | v51.37,11.37 52.94,9.81 IC1.28
  Bottom 0.2: v40.2,8.58 48.7,8.58 51.37,11.25 v51.37,11.37
SR_DAT  (via drill 0.35)
  Top 0.2: IC2.14 40.45,11.88 v40.39,11.82 | v50.74,12.26 50.61,12.14 50.61,10.36 52.14,8.83 IC1.27
  Bottom 0.2: v40.39,11.82 43.24,8.96 48.51,8.96 50.61,11.06 50.61,12.14 v50.74,12.26
STB_HALL_LEFT
  Top 0.2: IC10.2 21.7,21.49 26.29,16.9 36.13,16.9 39.24,13.79 43.12,13.79 43.62,13.28 43.62,11.18 44.13,10.68 IC1.22
STB_HALL_RIGHT
  Top 0.2: IC9.2 17.51,4.41 20.26,1.66 23.56,1.66 24.32,0.9 34.48,0.9 35.37,1.79 35.37,3.63 36.2,4.45 42.74,4.45 43.62,5.34 47.34,5.34 49.59,7.59 IC1.25
USB_DTR
  Top 0.2: IC4.13 68.77,6.55 68.14,5.91 68.14,4.71 66.74,3.31 63.18,3.31 63.06,3.18 C6.1
USB_N  (via drill 0.3 pad 0.4)
  Top 0.2: IC4.6 63.37,4.01 v62.99,4.39
  Bottom 0.2: v62.99,4.39 69.03,4.39 72.52,7.88 78.61,7.88 82.3,11.56 82.86,11.56 JP4.2
USB_P  (via drill 0.3 pad 0.4)
  Top 0.2: IC4.5 63.25,5.28 v62.99,5.53
  Bottom 0.2: v62.99,5.53 69.53,5.53 72.39,8.39 78.36,8.39 82.17,12.2 82.87,12.2 JP4.3
USB_RX
  Top 0.2: R3.1 62.38,7.82 IC4.3
USB_TX
  Top 0.2: R2.1 IC4.2
V+  (via drill 0.3 pad 0.4, 0.35)
  Top 0.152: C12.1 R12.2
  Top 0.2: AC1.14 50.66,21.8 50.42,22.04 49.21,22.04 48.88,21.71 AC1.1 v47.88,20.82 47.14,20.82 C14.2 | 68.41,10.36 68.41,7.97 66.99,6.55 IC4.4 | 68.41,10.36 C13.1 | IC4.16 68.41,10.36 | C20.1 8.46,19.59 IC7.1 14.5,19.59 15.18,20.27 18.16,20.27 v18.41,20.01 | C19.2 11.88,2.33 IC8.1 12.05,2.88 10.73,4.2 v10.73,5.6 | v21.34,5.28 21.34,6.45 C15.1 | IC2.10 40.71,6.8 v40.2,7.31 | v42.86,15.06 42.23,14.42 IC2.16 41.72,14.42 40.41,15.73 C7.1 38.51,18.23 D3.2 38.1,18.17 Q4.1
  Top 0.508: IC3.5 76.23,5.56 76.52,5.85 77.03,5.85 77.5,6.32 C10.1 77.5,8.96 C12.1 77.43,10.33 v76.83,10.93 | v69.85,11.56 69.34,12.07 C13.1 | U$3.11 21.4,7.44 | 21.4,7.44 21.4,8.43 C8.2 21.38,17.05 v18.41,20.01 | C15.1 21.38,7.41 21.4,7.44
  Bottom 0.2: 47.94,21.73 47.88,21.66 v47.88,20.82 | v10.73,5.6 11.24,6.1 20.51,6.1 v21.34,5.28 | v40.2,7.31 39.43,8.07 39.43,12.2 40.64,13.41 41.21,13.41 v42.86,15.06 42.86,18.3 42.41,18.75 41.47,18.75 40.01,20.21 40.01,21.73
  Bottom 0.508: v76.83,10.93 72.39,10.93 70.39,12.93 | 70.39,12.93 65.28,18.04 57.66,18.04 53.98,21.73 47.94,21.73 40.01,21.73 20.13,21.73 v18.41,20.01 | 70.39,12.93 69.85,12.39 v69.85,11.56

### Text on the board
tValues: 1 | - | - BAT + | - | 1 | 1 | 5V / / D+ / / D- / / / GND | 1 | 1 | RES | 1 | + MO - | - | -
bValues: (c) Ludwig Bre 03/23 / BREmote V1.1 Tx PCB